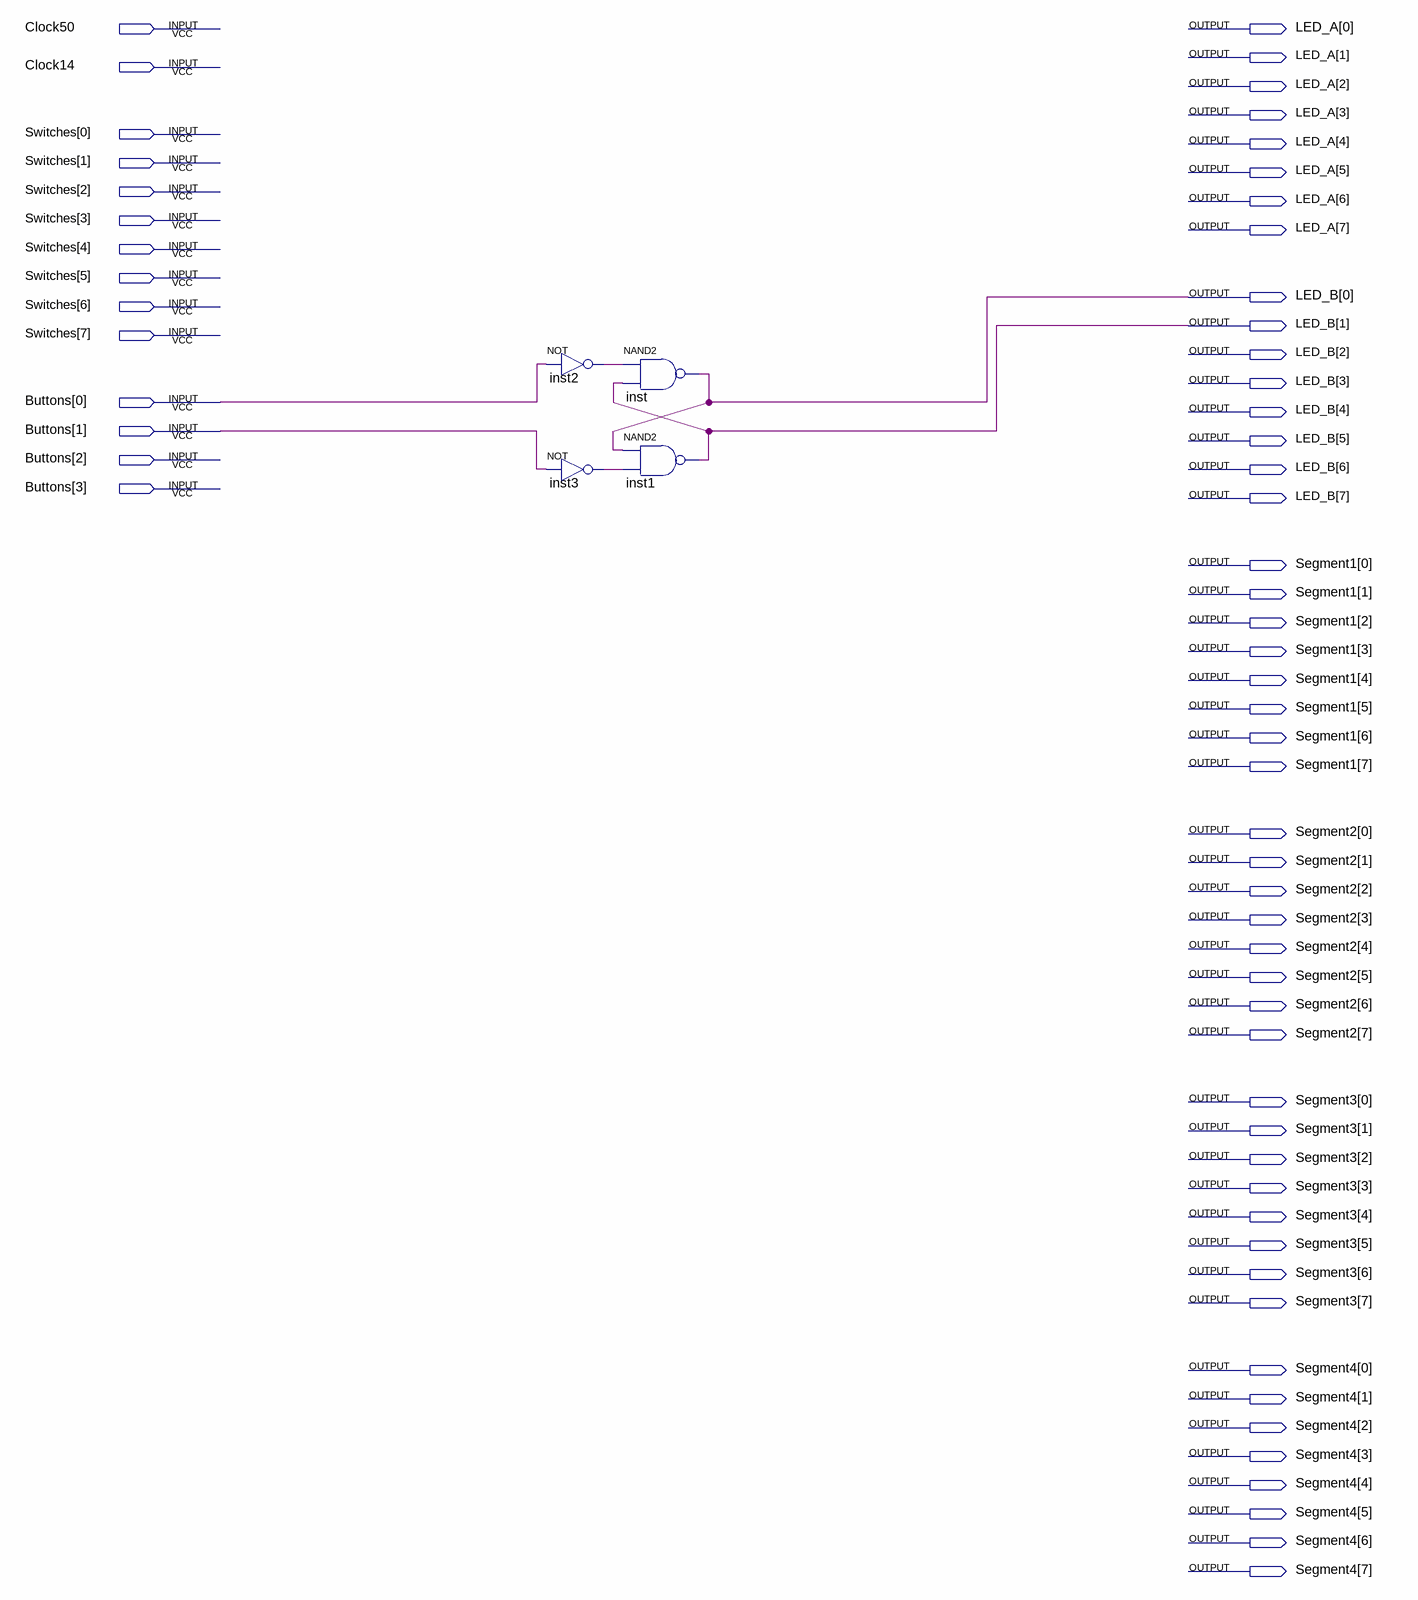
[diagram p0: schematic sheet]
// Quartus schematic RSFlipFlop.bdf as structural Verilog: 4 symbols, 62 pins
module RSFlipFlop (
  input  Clock50,
  input  Clock14,
  input  [7:0] Switches,
  input  [3:0] Buttons,
  output [7:0] LED_A,
  output [7:0] LED_B,
  output [7:0] Segment1,
  output [7:0] Segment2,
  output [7:0] Segment3,
  output [7:0] Segment4
);

  wire inst2_out, inst3_out;

  not inst2 (inst2_out, Buttons[0]);
  not inst3 (inst3_out, Buttons[1]);
  nand inst (LED_B[0], inst2_out, LED_B[1]);
  nand inst1 (LED_B[1], LED_B[0], inst3_out);
endmodule
